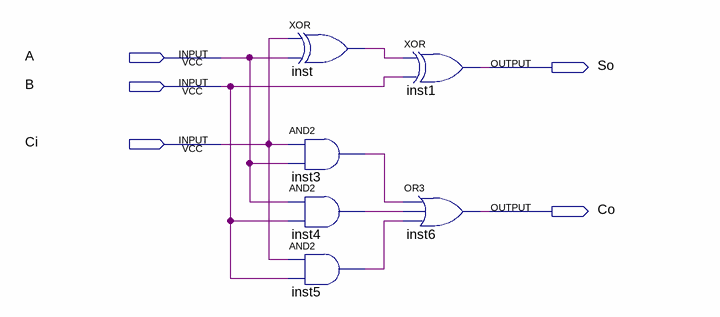
[diagram p0: schematic sheet]
// Quartus schematic Full_adder-1.bdf as structural Verilog: 6 symbols, 5 pins
module \Full_adder-1  (
  input  A,
  input  B,
  input  Ci,
  output So,
  output Co
);

  wire inst3_out, inst4_out, inst5_out, inst_out;

  xor inst (inst_out, Ci, A);
  and inst3 (inst3_out, Ci, A);
  and inst4 (inst4_out, A, B);
  and inst5 (inst5_out, Ci, B);
  xor inst1 (So, inst_out, B);
  or inst6 (Co, inst3_out, inst4_out, inst5_out);
endmodule
